# Altium schematic sheet 10K SMD Ceramic 201.schdoc
size 127 x 99 mm
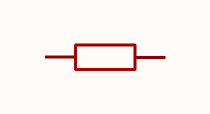
[diagram p0: 10K SMD Ceramic 201.schdoc]

## Parts
R?  10kΩ  [R0201]  (value not drawn)

## Nets

Not connected (* = marked no-connect by the designer): R? 1 2

## Library data of the parts
R? = AF0201FR-0710KL: Manufacturer: YAGEO(国巨); Add into BOM: yes; Tolerance: ±1%; Temperature Coefficient: ±200ppm/℃; Symbol: AF0201FR-0710KL; Device: AF0201FR-0710KL; LCSC Part Name: 厚膜电阻 10kΩ ±1% 50mW; Supplier Part: C143978; Manufacturer Part: AF0201FR-0710KL; Supplier Footprint: 0201; JLCPCB Part Class: Extended Part; Datasheet: https://atta.szlcsc.com/upload/public/pdf/source/20180927/C229861_4ABDC471507C1ED6AFB4BA66AFC8620A.pdf; Supplier: LCSC; Convert to PCB: yes; Type: Thick Film Resistors; Value: 10kΩ; Operating Temperature Range: -55℃~+125℃